# EAGLE schematic focus_coil_drive (EAGLE 7.5.0)
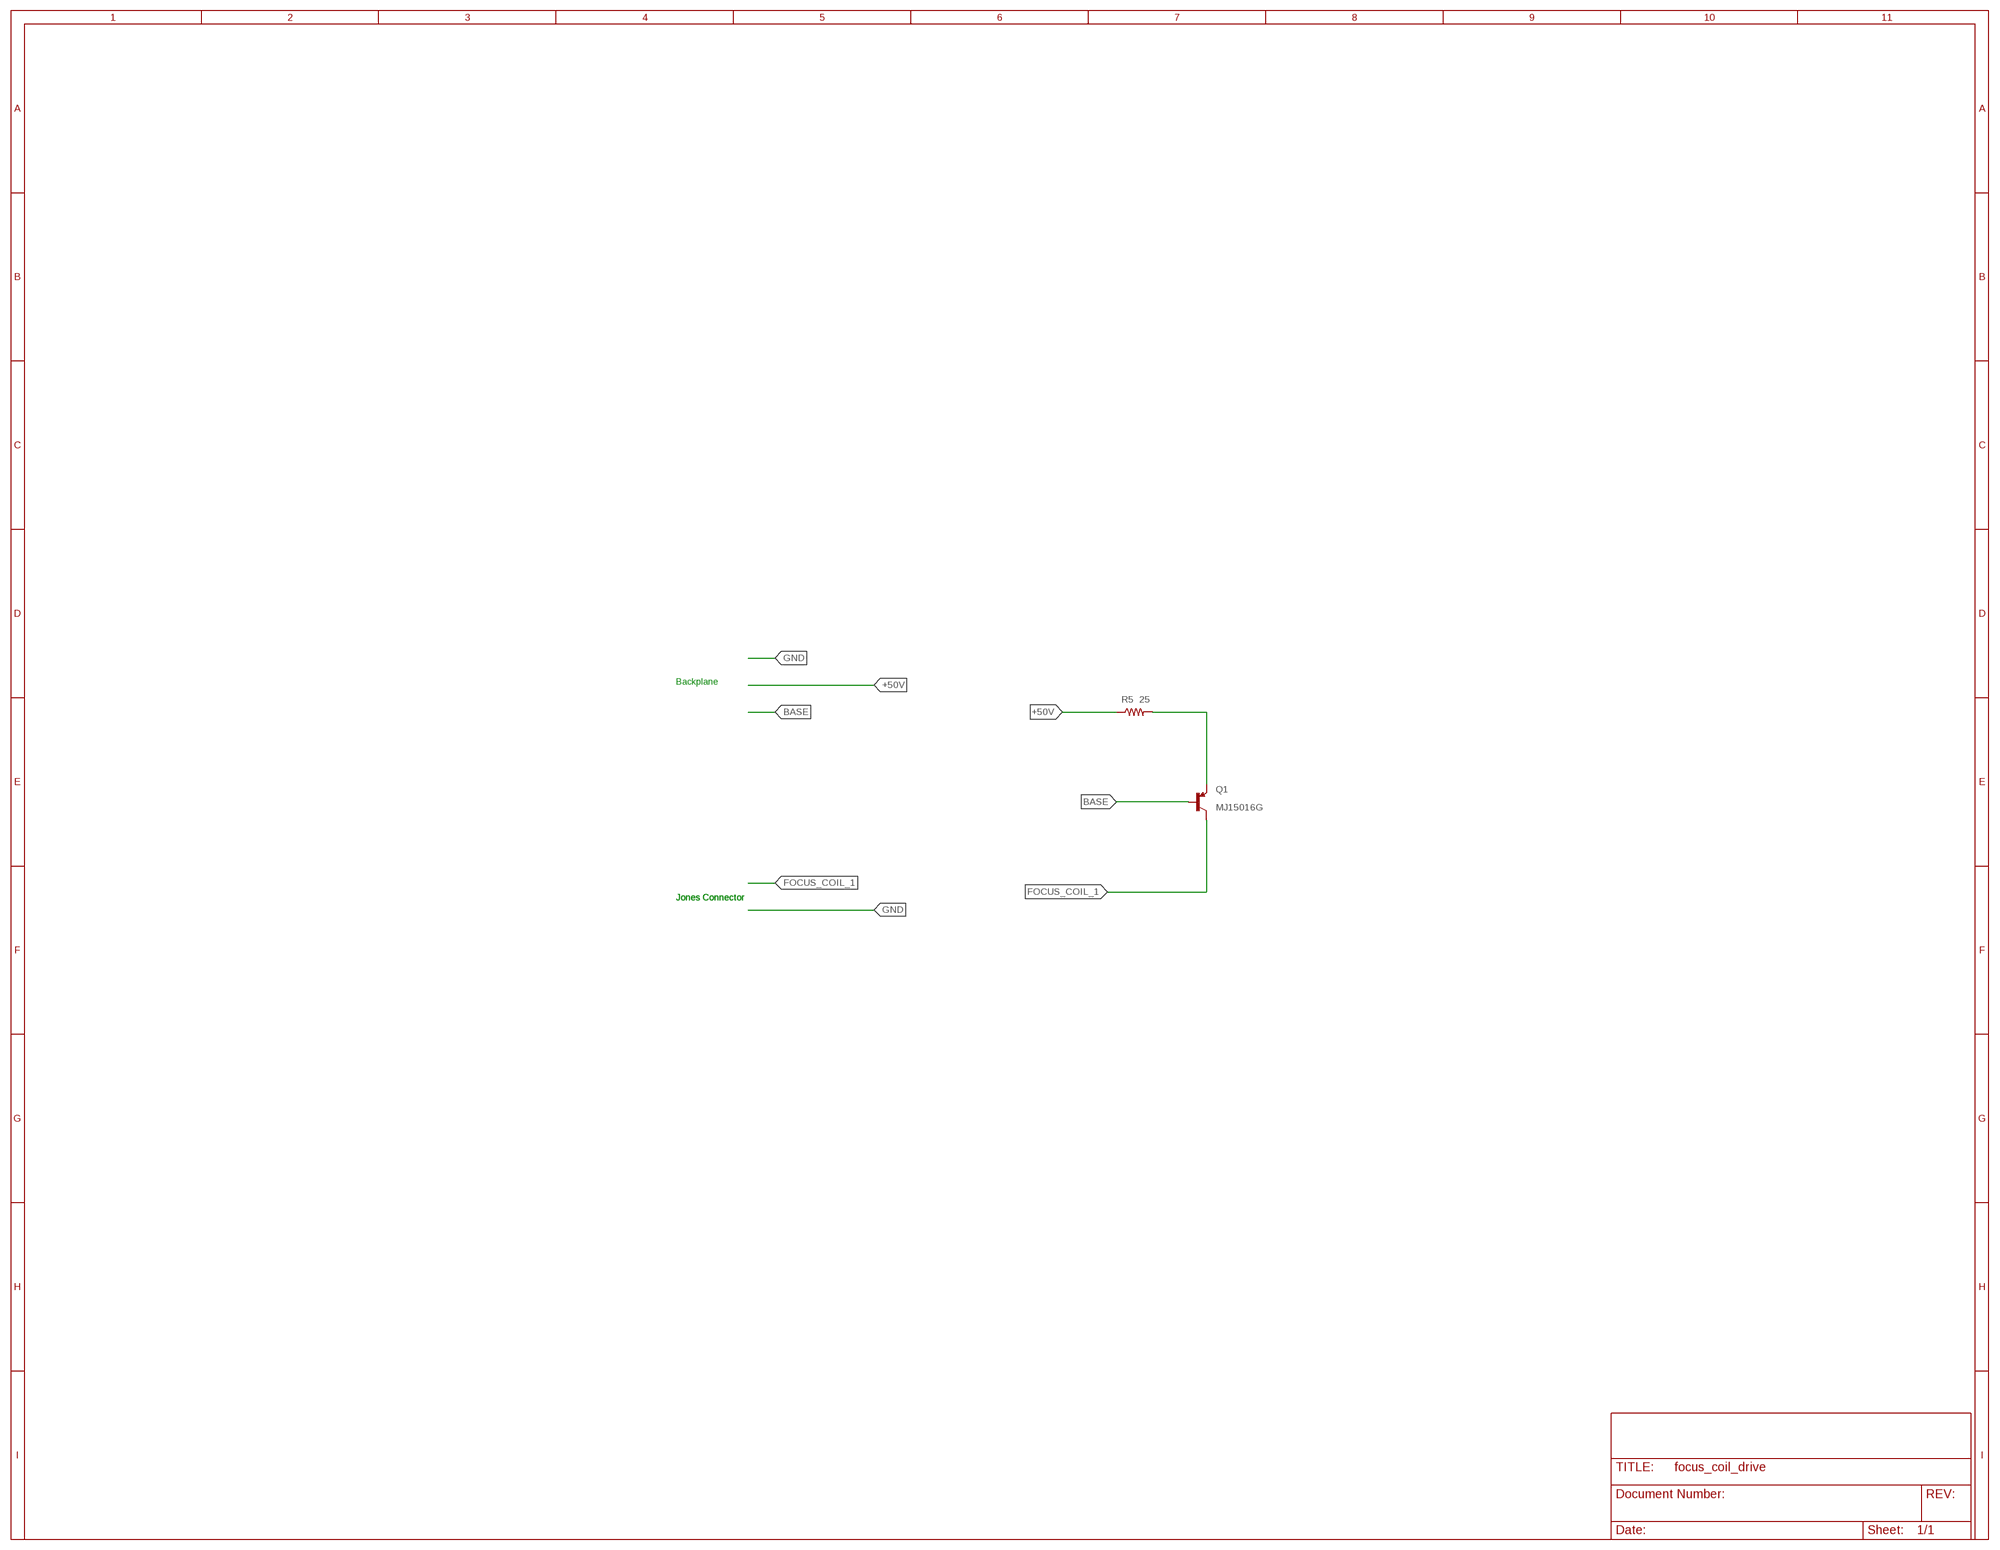
[diagram p0: schematic, sheet 1]

## Parts
Q1  MJ15016G  [TO3]
R5  25  RH-25-RESISTOR  [DALE-RH]

## Nets
+50V: R5.1
BASE: Q1.B
FOCUS_COIL_1: Q1.C Q1.C/(C)
N$4: Q1.E R5.2

## Notes on the sheet
- Backplane
- Jones Connector | Jones Connector

## Library data of the parts
Q1 = keiths:MJ15016G: PNP Transistor
R5 = keiths:RH-25-RESISTOR: Heatsink Encased Wirewound Power Resistors 25W